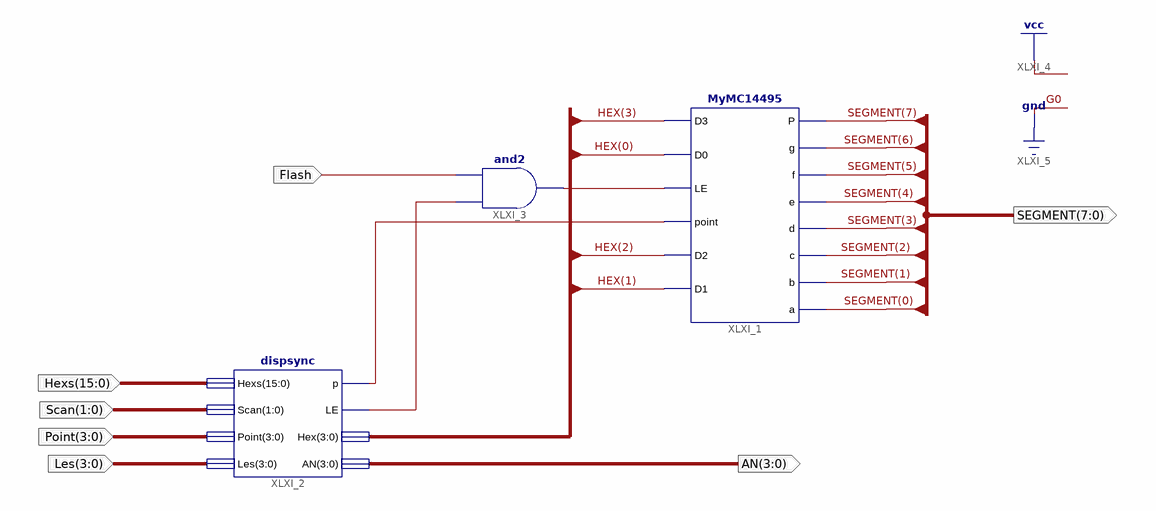
[diagram p0: schematic sheet 1]
// Xilinx ISE schematic Seg7_Dev.sch (kintex7) as structural Verilog: 3 symbols, 7 ports
module Seg7_Dev (
  input  Flash,
  input  [15:0] Hexs,
  input  [1:0] Scan,
  input  [3:0] Point,
  input  [3:0] Les,
  output [3:0] AN,
  output [7:0] SEGMENT
);

  wire XLXN_1, XLXN_3, XLXN_5;
  wire [3:0] HEX;

  MyMC14495 XLXI_1 (
    .D3(HEX[3]), .D0(HEX[0]), .LE(XLXN_5), .point(XLXN_1), .D2(HEX[2]), .D1(HEX[1]), .P(SEGMENT[7]),
    .g(SEGMENT[6]), .f(SEGMENT[5]), .e(SEGMENT[4]), .d(SEGMENT[3]), .c(SEGMENT[2]), .b(SEGMENT[1]),
    .a(SEGMENT[0]));
  dispsync XLXI_2 (.Hexs(Hexs), .Scan(Scan), .Point(Point), .Les(Les), .p(XLXN_1), .LE(XLXN_3), .Hex(HEX), .AN(AN));
  and XLXI_3 (XLXN_5, XLXN_3, Flash);
endmodule
